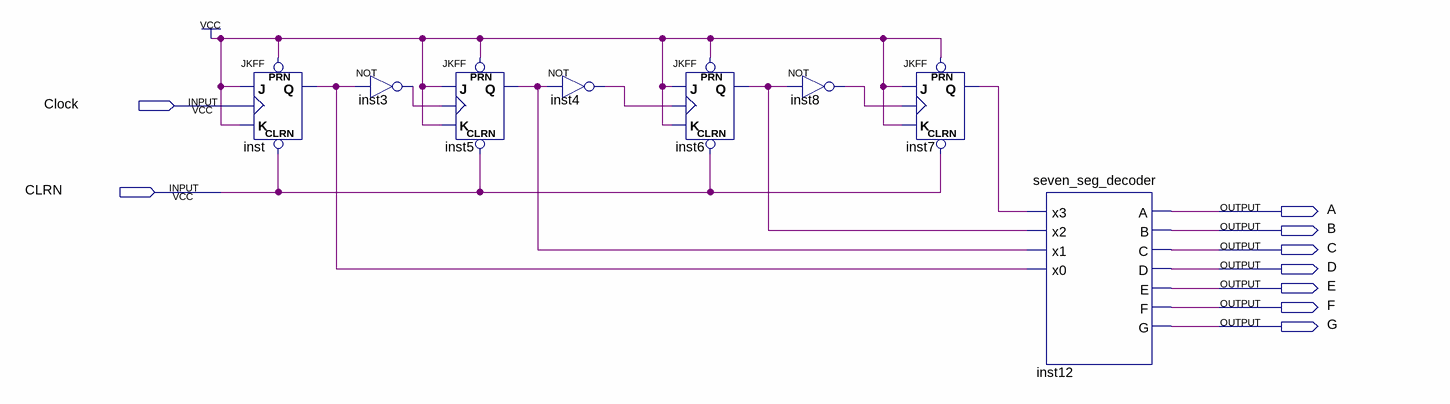
[diagram p0: schematic sheet]
// Quartus schematic lab10step3a.bdf as structural Verilog: 8 symbols, 9 pins
module lab10step3a (
  input  Clock,
  input  CLRN,
  output A,
  output B,
  output C,
  output D,
  output E,
  output F,
  output G
);

  wire inst3_out, inst4_out, inst5_q, inst6_q, inst7_q, inst8_out, inst_q;

  JKFF inst (.PRN(1'b1), .CLRN(CLRN), .K(1'b1), .J(1'b1), .CLK(Clock), .Q(inst_q));
  not inst3 (inst3_out, inst_q);
  JKFF inst5 (.PRN(1'b1), .CLRN(CLRN), .K(1'b1), .J(1'b1), .CLK(inst3_out), .Q(inst5_q));
  not inst4 (inst4_out, inst5_q);
  JKFF inst6 (.PRN(1'b1), .CLRN(CLRN), .K(1'b1), .J(1'b1), .CLK(inst4_out), .Q(inst6_q));
  not inst8 (inst8_out, inst6_q);
  JKFF inst7 (.PRN(1'b1), .CLRN(CLRN), .K(1'b1), .J(1'b1), .CLK(inst8_out), .Q(inst7_q));
  seven_seg_decoder inst12 (
    .x3(inst7_q), .x2(inst6_q), .x1(inst5_q), .x0(inst_q), .A(A), .B(B), .C(C), .D(D), .E(E), .F(F), .G(G));
endmodule
